# EAGLE design BLE_Board_WB55 (EAGLE 9.6.2)
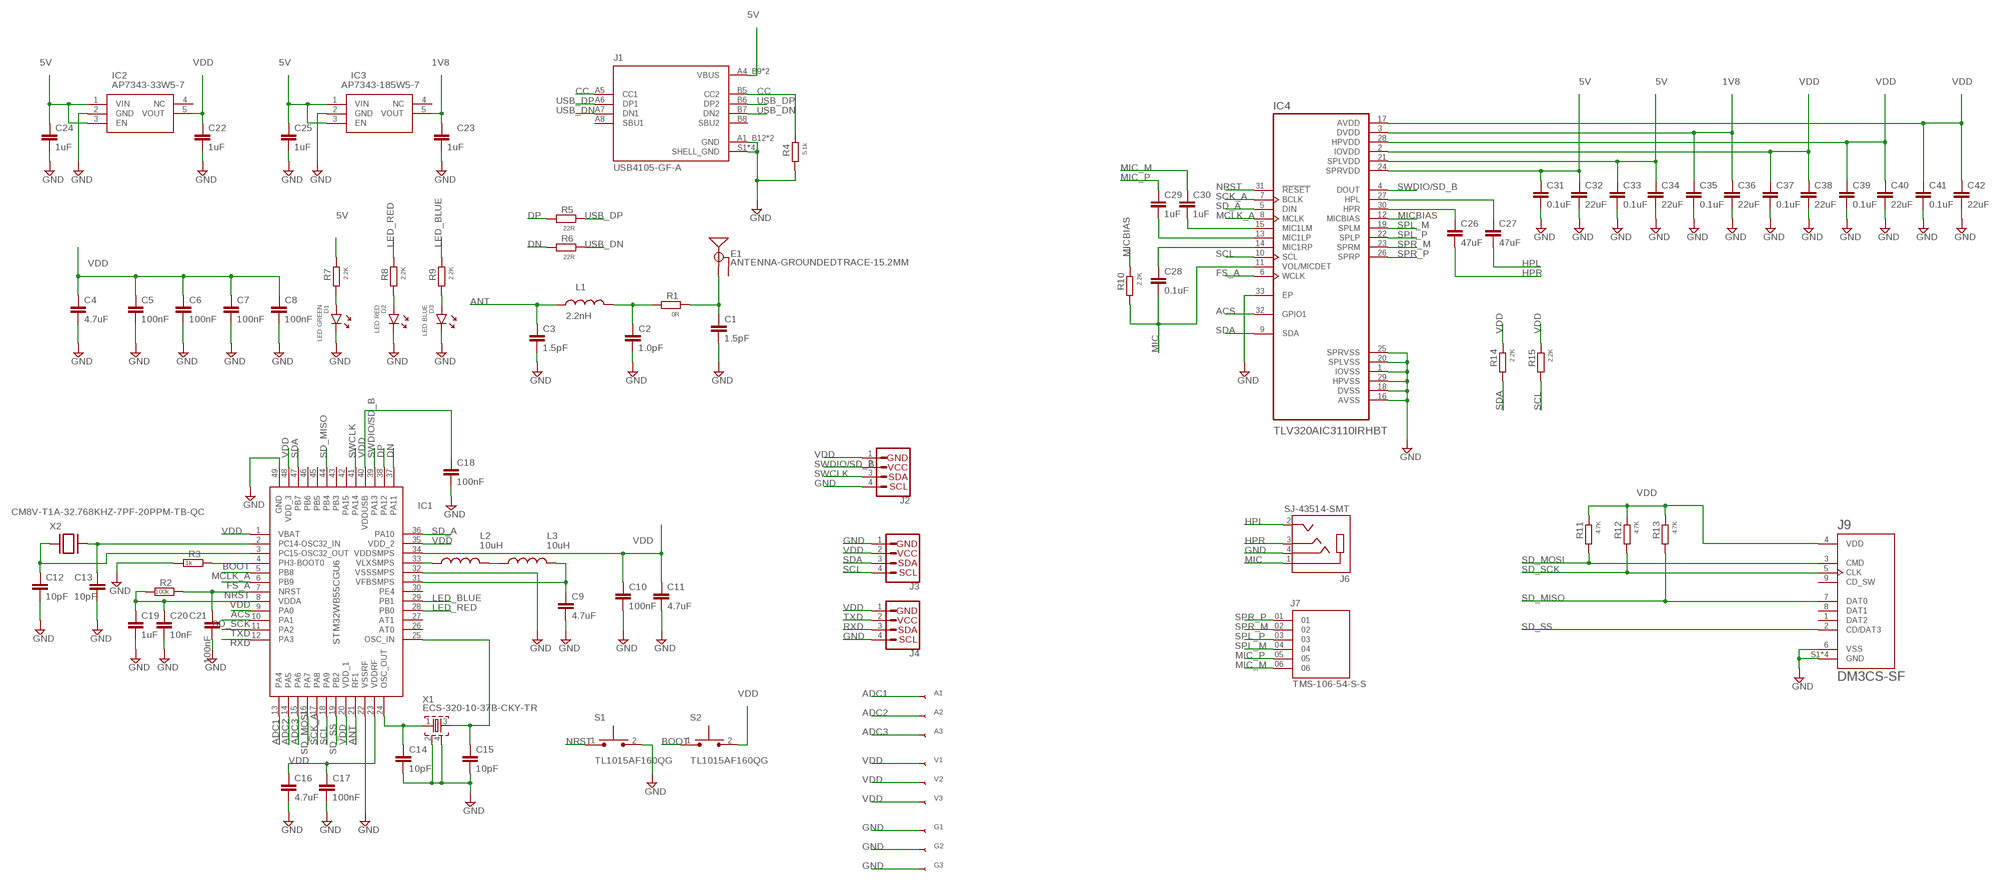
[diagram p0: schematic, sheet 1]

## Parts
A1  ATP-50  [ATP-50]
A2  ATP-50  [ATP-50]
A3  ATP-50  [ATP-50]
C1  1.5pF  CAPACITOR_0402_N  [RESC0402_N]
C2  1.0pF  CAPACITOR_0402_N  [RESC0402_N]
C3  1.5pF  CAPACITOR_0402_N  [RESC0402_N]
C4  4.7uF  CAPACITOR_0603_N  [RESC0603_N]
C5  100nF  CAPACITOR_0603_N  [RESC0603_N]
C6  100nF  CAPACITOR_0603_N  [RESC0603_N]
C7  100nF  CAPACITOR_0603_N  [RESC0603_N]
C8  100nF  CAPACITOR_0603_N  [RESC0603_N]
C9  4.7uF  CAPACITOR_0603_N  [RESC0603_N]
C10  100nF  CAPACITOR_0603_N  [RESC0603_N]
C11  4.7uF  CAPACITOR_0603_N  [RESC0603_N]
C12  10pF  CAPACITOR_0402_N  [RESC0402_N]
C13  10pF  CAPACITOR_0402_N  [RESC0402_N]
C14  10pF  CAPACITOR_0402_N  [RESC0402_N]
C15  10pF  CAPACITOR_0402_N  [RESC0402_N]
C16  4.7uF  CAPACITOR_0603_N  [RESC0603_N]
C17  100nF  CAPACITOR_0603_N  [RESC0603_N]
C18  100nF  CAPACITOR_0603_N  [RESC0603_N]
C19  1uF  CAPACITOR_0603_N  [RESC0603_N]
C20  10nF  CAPACITOR_0603_N  [RESC0603_N]
C21  100nF  CAPACITOR_0603_N  [RESC0603_N]
C22  1uF  CAPACITOR_0603_N  [RESC0603_N]
C23  1uF  CAPACITOR_0603_N  [RESC0603_N]
C24  1uF  CAPACITOR_0603_N  [RESC0603_N]
C25  1uF  CAPACITOR_0603_N  [RESC0603_N]
C26  47uF  CAPACITOR_0603_N  [RESC0603_N]
C27  47uF  CAPACITOR_0603_N  [RESC0603_N]
C28  0.1uF  CAPACITOR_0603_N  [RESC0603_N]
C29  1uF  CAPACITOR_0603_N  [RESC0603_N]
C30  1uF  CAPACITOR_0603_N  [RESC0603_N]
C31  0.1uF  CAPACITOR_0603_N  [RESC0603_N]
C32  22uF  CAPACITOR_0603_N  [RESC0603_N]
C33  0.1uF  CAPACITOR_0603_N  [RESC0603_N]
C34  22uF  CAPACITOR_0603_N  [RESC0603_N]
C35  0.1uF  CAPACITOR_0603_N  [RESC0603_N]
C36  22uF  CAPACITOR_0603_N  [RESC0603_N]
C37  0.1uF  CAPACITOR_0603_N  [RESC0603_N]
C38  22uF  CAPACITOR_0603_N  [RESC0603_N]
C39  0.1uF  CAPACITOR_0603_N  [RESC0603_N]
C40  22uF  CAPACITOR_0603_N  [RESC0603_N]
C41  0.1uF  CAPACITOR_0603_N  [RESC0603_N]
C42  22uF  CAPACITOR_0603_N  [RESC0603_N]
D1  LED GREEN  LED  [DIOC0603_N]
D2  LED RED  LED  [DIOC0603_N]
D3  LED BLUE  LED  [DIOC0603_N]
E1  ANTENNA-GROUNDEDTRACE-15.2MM  [TRACE_ANTENNA_2.4GHZ_15.2MM]
G1  ATP-50  [ATP-50]
G2  ATP-50  [ATP-50]
G3  ATP-50  [ATP-50]
IC1  STM32WB55CGU6  [QFN50P700X700X60-49N]
IC2  AP7343-33W5-7  [SOT95P285X140-5N]
IC3  AP7343-185W5-7  [SOT95P285X140-5N]
IC4  TLV320AIC3110IRHBT  [IC_ADS125H01IRHBT]
J1  USB4105-GF-A  [GCT_USB4105-GF-A]
J2  QWIIC_CONNECTORJS-1MM  [1X04_1MM_RA]
J3  QWIIC_CONNECTORJS-1MM  [1X04_1MM_RA]
J4  QWIIC_CONNECTORJS-1MM  [1X04_1MM_RA]
J6  SJ-43514-SMT  [CUI_SJ-43514-SMT]
J7  TMS-106-54-S-S  [SAMTEC_TMS-106-54-S-S]
J9  DM3CS-SF  [HRS_DM3CS-SF]
L1  2.2nH  INDUCTOR_0402_N  [RESC0402_N]
L2  10uH  INDUCTOR_0603_N  [RESC0603_N]
L3  10uH  INDUCTOR_0603_N  [RESC0603_N]
R1  0R  RESISTOR_0402_N  [RESC0402_N]
R2  100k  RESISTOR_0603_N  [RESC0603_N]
R3  1k  RESISTOR_0603_N  [RESC0603_N]
R4  5.1k  RESISTOR_0603_N  [RESC0603_N]
R5  22R  RESISTOR_0603_N  [RESC0603_N]
R6  22R  RESISTOR_0603_N  [RESC0603_N]
R7  2.2K  RESISTOR_0603_N  [RESC0603_N]
R8  2.2K  RESISTOR_0603_N  [RESC0603_N]
R9  2.2K  RESISTOR_0603_N  [RESC0603_N]
R10  2.2K  RESISTOR_0603_N  [RESC0603_N]
R11  4.7K  RESISTOR_0603_N  [RESC0603_N]
R12  4.7K  RESISTOR_0603_N  [RESC0603_N]
R13  4.7K  RESISTOR_0603_N  [RESC0603_N]
R14  2.2K  RESISTOR_0603_N  [RESC0603_N]
R15  2.2K  RESISTOR_0603_N  [RESC0603_N]
S1  TL1015AF160QG  [SW_TL1015AF160QG]
S2  TL1015AF160QG  [SW_TL1015AF160QG]
V1  ATP-50  [ATP-50]
V2  ATP-50  [ATP-50]
V3  ATP-50  [ATP-50]
X1  ECS-320-10-37B-CKY-TR  XTAL_32MHZ  [BT-XTAL_2016_N]
X2  CM8V-T1A-32.768KHZ-7PF-20PPM-TB-QC  [XTAL_CM8V-T1A-32.768KHZ-7PF-20PPM-TB-QC]

## Nets
1V8 [power]: C23.1 C35.1 C36.1 IC3.5(VOUT) IC4.3(DVDD)
5V [power]: C24.1 C25.1 C31.1 C32.1 C33.1 C34.1 IC2.1(VIN) IC2.3(EN) IC3.1(VIN) IC3.3(EN) IC4.21(SPLVDD) IC4.24(SPRVDD) J1.A4_B9(VBUS) J1.B4_A9(VBUS) R7.1
ACS: IC1.9(PA0) IC4.32(GPIO1)
ADC1: A1.P(TP) IC1.13(PA4)
ADC2: A2.P(TP) IC1.14(PA5)
ADC3: A3.P(TP) IC1.15(PA6)
ANT: C3.1 IC1.21(RF1) L1.1
BOOT: IC1.4(PH3-BOOT0) R3.1 S2.1
CC: J1.A5(CC1) J1.B5(CC2) R4.1
DN: IC1.37(PA11) R6.2
DP: IC1.38(PA12) R5.2
FS_A: IC1.6(PB9) IC4.6(WCLK)
GND [power]: C1.2 C2.2 C3.2 C4.2 C5.2 C6.2 C7.2 C8.2 C9.2 C10.2 C11.2 C12.2 C13.2 C14.2 C15.2 C16.2 C17.2 C18.2 C19.2 C20.2 C21.2 C22.2 C23.2 C24.2 C25.2 C31.2 C32.2 C33.2 C34.2 C35.2 C36.2 C37.2 C38.2 C39.2 C40.2 C41.2 C42.2 D1.1(C) D2.1(C) D3.1(C) G1.P(TP) G2.P(TP) G3.P(TP) IC1.22(VSSRF) IC1.32(VSSSMPS) IC1.49(GND) IC2.2(GND) IC3.2(GND) IC4.1(IOVSS) IC4.16(AVSS) IC4.18(DVSS) IC4.20(SPLVSS) IC4.25(SPRVSS) IC4.29(HPVSS) IC4.33(EP) J1.A1_B12(GND) J1.B1_A12(GND) J1.S1(SHELL_GND) J1.S2(SHELL_GND) J1.S3(SHELL_GND) J1.S4(SHELL_GND) J2.4 J3.1 J4.4 J6.4(RING2) J9.6(VSS) J9.S1(GND) J9.S2(GND) J9.S3(GND) J9.S5(GND) R3.2 R4.2 S1.2 X1.2 X1.4
HPL: C27.2 J6.2(TIP)
HPR: C26.2 J6.3(RING1)
LED_BLUE: IC1.29(PB1) R9.1
LED_RED: IC1.28(PB0) R8.1
MCLK_A: IC1.5(PB8) IC4.8(MCLK)
MIC: C28.2 IC4.11(VOL/MICDET) J6.1(SLEEVE) R10.2
MIC_M: C30.1 J7.06
MIC_P: C29.1 J7.05
MICBIAS: IC4.12(MICBIAS) R10.1
N$1: C1.1 E1.ANT(SIGNAL) R1.2
N$2: C2.1 L1.2 R1.1
N$3: IC1.33(VLXSMPS) L2.1
N$4: L2.2 L3.1
N$5: C9.1 IC1.31(VFBSMPS) L3.2
N$6: C13.1 IC1.2(PC14-OSC32_IN) X2.2
N$7: C12.1 IC1.3(PC15-OSC32_OUT) X2.1
N$8: C14.1 IC1.24(OSC_OUT) X1.1
N$9: C15.1 IC1.25(OSC_IN) X1.3
N$10: D1.2(A) R7.2
N$14: C26.1 IC4.30(HPR)
N$16: C28.1 IC4.14(MIC1RP)
N$17: D3.2(A) R9.2
N$18: D2.2(A) R8.2
N$19: C27.1 IC4.27(HPL)
N$20: C30.2 IC4.15(MIC1LM)
N$21: C29.2 IC4.13(MIC1LP)
NRST: C21.1 IC1.7(NRST) IC4.31(!RESET) R2.1 S1.1
RXD: IC1.12(PA3) J4.3
SCK_A: IC1.17(PA8) IC4.7(BCLK)
SCL: IC1.18(PA9) IC4.10(SCL) J3.4 R15.2
SD_A: IC1.36(PA10) IC4.5(DIN)
SD_MISO: IC1.44(PB4) J9.7(DAT0) R13.2
SD_MOSI: IC1.16(PA7) J9.3(CMD) R11.2
SD_SCK: IC1.10(PA1) J9.5(CLK) R12.2
SD_SS: IC1.19(PB2) J9.2(CD/DAT3)
SDA: IC1.47(PB7) IC4.9(SDA) J3.3 R14.2
SPL_M: IC4.19(SPLM) J7.04
SPL_P: IC4.22(SPLP) J7.03
SPR_M: IC4.23(SPRM) J7.02
SPR_P: IC4.26(SPRP) J7.01
SWCLK: IC1.41(PA14) J2.3
SWDIO/SD_B: IC1.39(PA13) IC4.4(DOUT) J2.2
TXD: IC1.11(PA2) J4.2
USB_DN: J1.A7(DN1) J1.B7(DN2) R6.1
USB_DP: J1.A6(DP1) J1.B6(DP2) R5.1
VDD [power]: C4.1 C5.1 C6.1 C7.1 C8.1 C10.1 C11.1 C16.1 C17.1 C18.1 C19.1 C20.1 C22.1 C37.1 C38.1 C39.1 C40.1 C41.1 C42.1 IC1.1(VBAT) IC1.8(VDDA) IC1.20(VDD_1) IC1.23(VDDRF) IC1.34(VDDSMPS) IC1.35(VDD_2) IC1.40(VDDUSB) IC1.48(VDD_3) IC2.5(VOUT) IC4.2(IOVDD) IC4.17(AVDD) IC4.28(HPVDD) J2.1 J3.2 J4.1 J9.4(VDD) R2.2 R11.1 R12.1 R13.1 R14.1 R15.1 S2.2 V1.P(TP) V2.P(TP) V3.P(TP)
Unconnected: E1.GND IC1.26(AT0) IC1.27(AT1) IC1.30(PE4) IC1.42(PA15) IC1.43(PB3) IC1.45(PB5) IC1.46(PB6) IC2.4(NC) IC3.4(NC) J1.A8(SBU1) J1.B8(SBU2) J9.1(DAT2) J9.8(DAT1) J9.9(CD_SW)

## Library data of the parts
A1-A3 G1-G3 V1-V3 = testpoint:ATP: AUTOMATED TEST POINT for automated bed of nails machinery; BOM: EXCLUDE; POGOPIN: T
C1-C42 = Nordic_misc:CAPACITOR: Generic chip capacitor
D1-D3 = Nordic_misc:LED
E1 = SparkFun-RF:ANTENNA-GROUNDED: Antenna w/ Ground Connection 2.4GHz antennae with signal and ground terminals. TRACE_ANTENNA_2.4GHZ_15.2MM - Meander Trace antenna 15.2 x 5.7mm footprint Based on layout from TI app note AN043. TRACE_ANTENNA_2.4GHZ_25.7MM - Inverted F trace antenna 25.7 x 7.5 mm footprint. Based on layout from TI design note DN0007.
IC1 = STM32WB55CGU6:STM32WB55CGU6: ARM Microcontrollers - MCU Ultra-low-power dual core Arm Cortex-M4 MCU 64 MHz, Cortex-M0 32MHz with 1 Mbyte Flash, BLE, 802.15.4, USB, LCD, AES-256 Source: Datasheet; ARROW_PART_NUMBER: STM32WB55CGU6; ARROW_PRICE-STOCK: https://www.arrow.com/en/products/stm32wb55cgu6/stmicroelectronics?region=nac; DESCRIPTION: ARM Microcontrollers - MCU Ultra-low-power dual core Arm Cortex-M4 MCU 64 MHz, Cortex-M0 32MHz with 1 Mbyte Flash, BLE, 802.15.4, USB, LCD, AES-256; HEIGHT: 0.6mm; MANUFACTURER_NAME: STMicroelectronics; MANUFACTURER_PART_NUMBER: STM32WB55CGU6; MOUSER_PART_NUMBER: 511-STM32WB55CGU6; MOUSER_PRICE-STOCK: https://www.mouser.co.uk/ProductDetail/STMicroelectronics/STM32WB55CGU6?qs=lYGu3FyN48eI3bRY%252B36gew%3D%3D
IC2 = AP7343-33W5-7:AP7343-33W5-7: 300mA HIGH PSRR LOW NOISE LDO WITH ENABLE SOT25 Source: Datasheet; ARROW_PART_NUMBER: AP7343-33W5-7; ARROW_PRICE-STOCK: https://www.arrow.com/en/products/ap7343-33w5-7/diodes-incorporated?region=nac; DESCRIPTION: 300mA HIGH PSRR LOW NOISE LDO WITH ENABLE SOT25; HEIGHT: 1.4mm; MANUFACTURER_NAME: Diodes Inc.; MANUFACTURER_PART_NUMBER: AP7343-33W5-7; MOUSER_PART_NUMBER: 621-AP7343-33W5-7; MOUSER_PRICE-STOCK: https://www.mouser.co.uk/ProductDetail/Diodes-Incorporated/AP7343-33W5-7?qs=EDJ299gKAZRup5M081DV0A%3D%3D
IC3 = AP7343-185W5-7:AP7343-185W5-7: DiodesZetex AP7343-185W5-7, LDO Regulator, 300mA, 1.85 V, +/-1%, 1.7 5.25 Vin, SOT-25 5-Pin Source: Datasheet; ARROW_PART_NUMBER: AP7343-185W5-7; ARROW_PRICE-STOCK: https://www.arrow.com/en/products/ap7343-185w5-7/diodes-incorporated; DESCRIPTION: DiodesZetex AP7343-185W5-7, LDO Regulator, 300mA, 1.85 V, +/-1%, 1.7 5.25 Vin, SOT-25 5-Pin; HEIGHT: 1.4mm; MANUFACTURER_NAME: Diodes Inc.; MANUFACTURER_PART_NUMBER: AP7343-185W5-7; MOUSER_PART_NUMBER: 621-AP7343-185W5-7; MOUSER_PRICE-STOCK: https://www.mouser.co.uk/ProductDetail/Diodes-Incorporated/AP7343-185W5-7?qs=EDJ299gKAZSDDLW23DUnJA%3D%3D
IC4 = TLV320AIC3110IRHBT:TLV320AIC3110IRHBT: Check availability; AVAILABILITY: In Stock; DESCRIPTION: Low-Power Audio Codec With 1.3W Stereo Class-D Speaker Amplifier; MF: Texas Instruments; MP: TLV320AIC3110IRHBT; PACKAGE: VQFN-32-32 Texas Instruments; PRICE: None; PURCHASE-URL: https://pricing.snapeda.com/search?q=TLV320AIC3110IRHBT&ref=eda
J1 = USB4105-GF-A:USB4105-GF-A: USB-C (USB TYPE-C) USB 2.0 Receptacle Connector 24 (16+8 Dummy) Position Surface Mount, Right Angle; Through Hole Check availability; AVAILABILITY: In Stock; DESCRIPTION: USB-C (USB TYPE-C) USB 2.0 Receptacle Connector 24 (16+8 Dummy) Position Surface Mount, Right Angle; Through Hole; MF: GCT; MP: USB4105-GF-A; PACKAGE: None; PRICE: None; PURCHASE-URL: https://pricing.snapeda.com/search?q=USB4105-GF-A&ref=eda
J2-J4 = SparkFun-Connectors:QWIIC_CONNECTOR: SparkFun I2C Standard Qwiic Connector An SMD 1mm pitch JST connector makes it easy and quick (get it? Qwiic?) to connect I2C devices to each other. The Qwiic system <http://www.sparkfun.com/qwiic> enables fast and solderless connection between popular platforms and various sensors and actuators. We carry 200mm <https://www.sparkfun.com/products/14204>, 100mm <https://www.sparkfun.com/products/14205>, 50mm <https://www.sparkfun.com/products/14206>, and breadboard friendly <https://www.sparkfun.com/products/14207> Qwiic cables. We also offer 10 pcs strips <https://www.sparkfun.com/products/14323> the SMD connectors.; PROD_ID: CONN-13694
J6 = SJ-43514-SMT:SJ-43514-SMT: 4 conductor 3.5 mm Surface Mount Audio Jack Check availability; AVAILABILITY: In Stock; CUI_PURCHASE_URL: https://www.cuidevices.com/product/interconnect/connectors/audio-connectors/jacks/sj-43514-smt-tr?utm_source=snapeda.com&utm_medium=referral&utm_campaign=snapedaBOM; DESCRIPTION: 4 conductor 3.5 mm Surface Mount Audio Jack; MF: CUI Devices; MP: SJ-43514-SMT-TR; PACKAGE: None; PRICE: None; PURCHASE-URL: https://pricing.snapeda.com/search?q=SJ-43514-SMT-TR&ref=eda
J7 = TMS-106-54-S-S:TMS-106-54-S-S: Check availability; AVAILABILITY: In Stock; DESCRIPTION: Connector Header Through Hole 6 position 0.050 (1.27mm); MF: Samtec; MP: TMS-106-54-S-S; PACKAGE: None; PRICE: None; PURCHASE-URL: https://pricing.snapeda.com/search?q=TMS-106-54-S-S&ref=eda
J9 = DM3CS-SF:DM3CS-SF: CONN MICRO SD CARD HINGED TYPE Check availability; AVAILABILITY: In Stock; DESCRIPTION: 10 (8 + 2) Position Card Connector Secure Digital - microSD™ Surface Mount, Right Angle Gold; MF: Hirose; MP: DM3CS-SF; PACKAGE: None; PRICE: None; PURCHASE-URL: https://pricing.snapeda.com/search?q=DM3CS-SF&ref=eda
L1-L3 = Nordic_misc:INDUCTOR: Generic chip inductor
R1-R15 = Nordic_misc:RESISTOR: Generic chip resistor
S1 S2 = TL1015AF160QG:TL1015AF160QG: Tactile Switch SPST-NO Top Actuated Surface Mount Check availability; AVAILABILITY: In Stock; DESCRIPTION: Tactile Switch SPST-NO Top Actuated Surface Mount; MF: E-Switch; MP: TL1015AF160QG; PACKAGE: None; PRICE: None; PURCHASE-URL: https://pricing.snapeda.com/search?q=TL1015AF160QG&ref=eda
X1 = Nordic_nRF:XTAL_32MHZ
X2 = CM8V-T1A-32.768KHZ-7PF-20PPM-TB-QC:CM8V-T1A-32.768KHZ-7PF-20PPM-TB-QC: Check availability; AVAILABILITY: In Stock; DESCRIPTION: LOW FREQUENCY CRYSTAL; MF: Micro Crystal AG; MP: CM8V-T1A-32.768KHZ-7PF-20PPM-TB-QC; PACKAGE: SMD-2 Micro Crystal; PRICE: None; PURCHASE-URL: https://pricing.snapeda.com/search?q=CM8V-T1A-32.768KHZ-7PF-20PPM-TB-QC&ref=eda

## Net classes
0 default: width 0.178 mm
3 power: width 0.254 mm

## Board
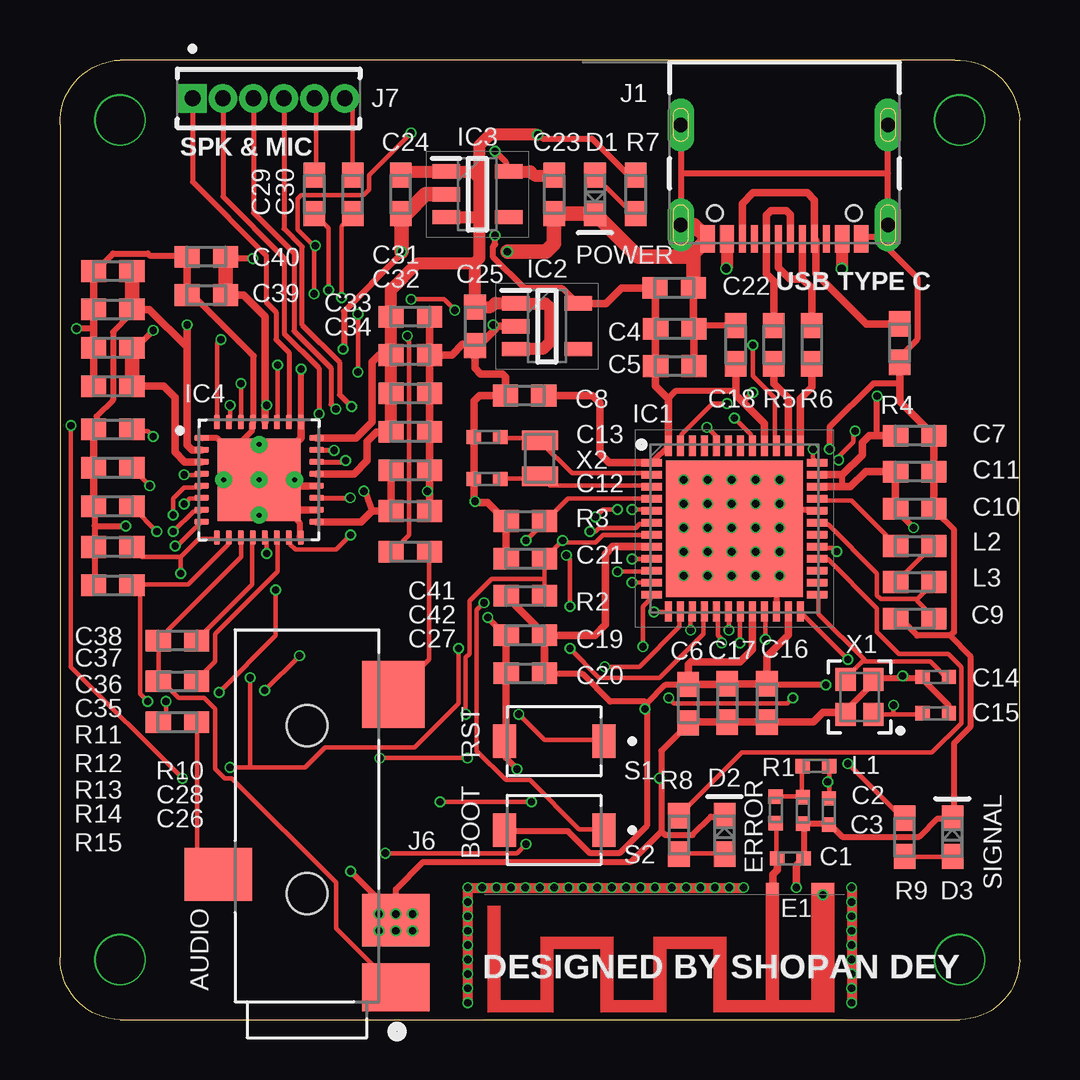
[diagram p1: board, top side]
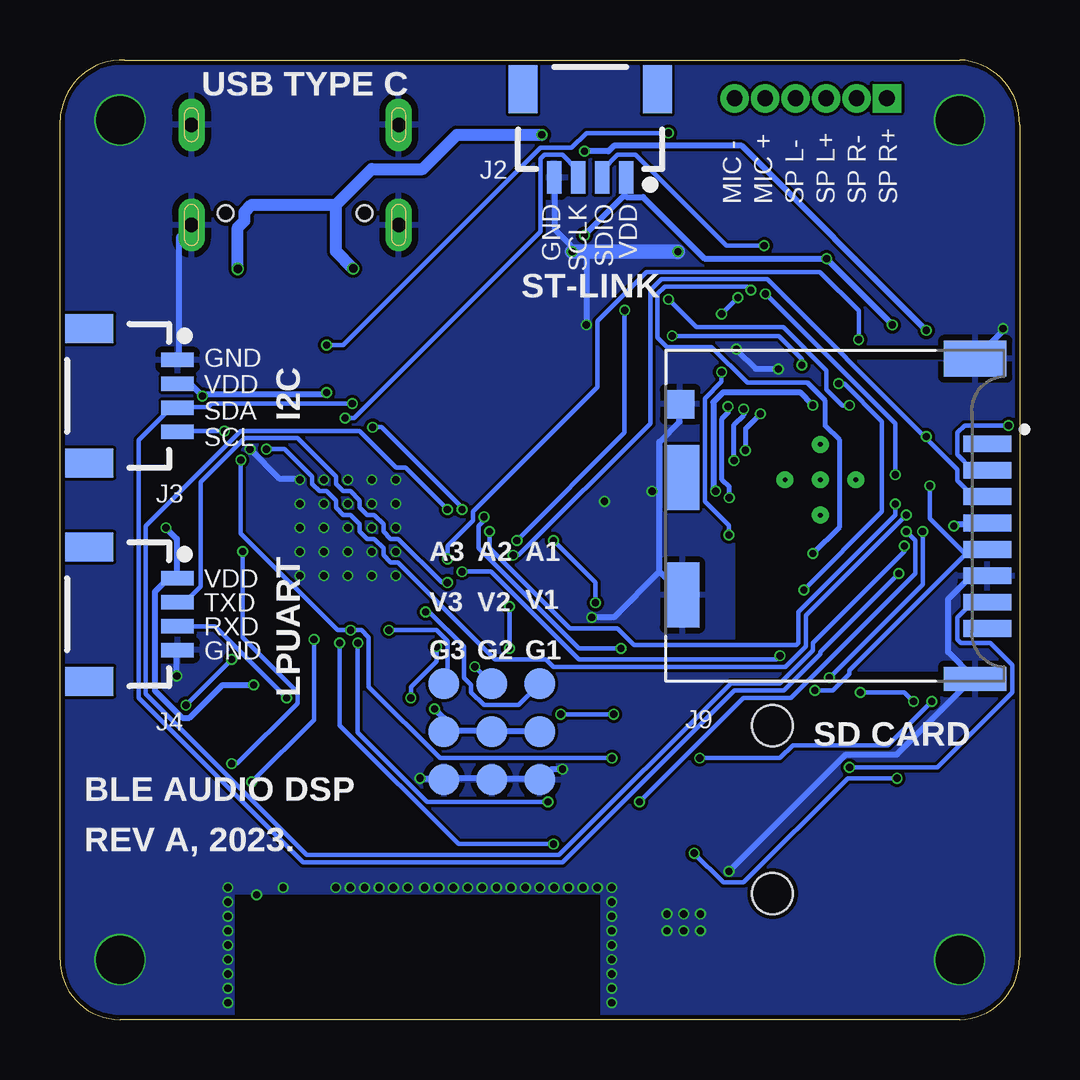
[diagram p2: board, bottom side, seen from below]

Size 40 x 40 mm. Coordinates in mm from the lower left corner, seen from the top.
Outline: 2.5,0 37.5,0 arc90 40,2.5 40,37.5 arc90 37.3,40 2.5,40 arc90 0,37.3 0,2.6 arc90 2.5,0
Copper layers (1*16): Top 0.035mm / dielectric 1.6mm / Bottom 0.035mm
Design rules "jlcpcb-2layers *": minimum track width 5mil, minimum drill 0.3mm, track to track 5mil, track to pad 5mil, pad to pad 5mil, via to via 5mil, smd to smd 5mil, copper to edge 0.2mm, drill to drill 6mil, minimum pad ring 10mil, minimum via ring 3mil, stop-mask expansion 4mil, vias tented up to drill 40mil, thermal gap 10mil
tRestrict: area 17.5,0.1 to 32.7,5.2
bRestrict: area 17.5,0.1 to 32.7,5.2
vRestrict: area 17.2,-0.6 to 32.9,5.2

### Footprints (pad centres in the part's own frame; a part is rotated, then mirrored left to right if it is on the bottom)
ATP-50 = smd 1.27 x 1.27: P 0,0
RESC0402_N = smd 0.6 x 0.6: 1 -0.55,0; 2 0.55,0
RESC0603_N = smd 1.05 x 0.9: 1 -0.8,0; 2 0.8,0
DIOC0603_N = smd 1.05 x 0.9: 1 -0.8,0; 2 0.8,0
TRACE_ANTENNA_2.4GHZ_15.2MM = smd 0.5 x 0.5: ANT 0,-0.25 | smd 0.9 x 0.5: GND -2.1,-0.25
QFN50P700X700X60-49N = smd 0.85 x 0.3: 1 -3.45,2.75; 2 -3.45,2.25; 3 -3.45,1.75; 4 -3.45,1.25; 5 -3.45,0.75; 6 -3.45,0.25; 7 -3.45,-0.25; 8 -3.45,-0.75; 9 -3.45,-1.25; 10 -3.45,-1.75; 11 -3.45,-2.25; 12 -3.45,-2.75; 25 3.45,-2.75; 26 3.45,-2.25; 27 3.45,-1.75; 28 3.45,-1.25; 29 3.45,-0.75; 30 3.45,-0.25; 31 3.45,0.25; 32 3.45,0.75; 33 3.45,1.25; 34 3.45,1.75; 35 3.45,2.25; 36 3.45,2.75 | smd 0.3 x 0.85: 13 -2.75,-3.45; 14 -2.25,-3.45; 15 -1.75,-3.45; 16 -1.25,-3.45; 17 -0.75,-3.45; 18 -0.25,-3.45; 19 0.25,-3.45; 20 0.75,-3.45; 21 1.25,-3.45; 22 1.75,-3.45; 23 2.25,-3.45; 24 2.75,-3.45; 37 2.75,3.45; 38 2.25,3.45; 39 1.75,3.45; 40 1.25,3.45; 41 0.75,3.45; 42 0.25,3.45; 43 -0.25,3.45; 44 -0.75,3.45; 45 -1.25,3.45; 46 -1.75,3.45; 47 -2.25,3.45; 48 -2.75,3.45 | smd 5.7 x 5.7: 49 0,0
SOT95P285X140-5N = smd 1.15 x 0.6: 1 -1.3,0.95; 2 -1.3,0; 3 -1.3,-0.95; 4 1.3,-0.95; 5 1.3,0.95
IC_ADS125H01IRHBT = smd 0.6 x 0.25: 1 -2.4,1.75; 2 -2.4,1.25; 3 -2.4,0.75; 4 -2.4,0.25; 5 -2.4,-0.25; 6 -2.4,-0.75; 7 -2.4,-1.25; 8 -2.4,-1.75; 17 2.4,-1.75; 18 2.4,-1.25; 19 2.4,-0.75; 20 2.4,-0.25; 21 2.4,0.25; 22 2.4,0.75; 23 2.4,1.25; 24 2.4,1.75 | smd 0.25 x 0.6: 9 -1.75,-2.4; 10 -1.25,-2.4; 11 -0.75,-2.4; 12 -0.25,-2.4; 13 0.25,-2.4; 14 0.75,-2.4; 15 1.25,-2.4; 16 1.75,-2.4; 25 1.75,2.4; 26 1.25,2.4; 27 0.75,2.4; 28 0.25,2.4; 29 -0.25,2.4; 30 -0.75,2.4; 31 -1.25,2.4; 32 -1.75,2.4 | smd 3.45 x 3.45: 33 0,0 | drill 0.2 pad 0.4: 34 0,0; 35 0,1.475; 36 -1.475,0; 37 0,-1.475; 38 1.475,0
GCT_USB4105-GF-A = smd 0.6 x 1.15: A1_B12 -3.2,4.755; A4_B9 -2.4,4.755; B1_A12 3.2,4.755; B4_A9 2.4,4.755 | smd 0.3 x 1.15: A5 -1.25,4.755; A6 -0.25,4.755; A7 0.25,4.755; A8 1.25,4.755; B5 1.75,4.755; B6 0.75,4.755; B7 -0.75,4.755; B8 -1.75,4.755 | drill 0.6 pad 1.05 long: S1 -4.32,4.18; S4 4.32,4.18 | drill 0.6 pad 1 long: S2 -4.32,0; S3 4.32,0 | hole 0.65: 2.89,3.68; -2.89,3.68
1X04_1MM_RA = smd 0.6 x 1.35: 1 -1.5,0; 2 -0.5,0; 3 0.5,0; 4 1.5,0 | smd 1.2 x 2: NC1 2.8,-3.675; NC2 -2.8,-3.675
CUI_SJ-43514-SMT = smd 2 x 2.8: 1 -7.15,-3.7 | smd 2.8 x 2.6: 2 5.05,-3.6 | smd 2.2 x 2.8: 3 -2.45,3.7; 4 -4.35,-3.7 | hole 1.7: -3.25,0; 3.75,0
SAMTEC_TMS-106-54-S-S = drill 0.66 pad 1.01 square: 01 -3.175,0 | drill 0.66 pad 1.01: 02 -1.905,0; 03 -0.635,0; 04 0.635,0; 05 1.905,0; 06 3.175,0
HRS_DM3CS-SF = smd 0.7 x 2: 1 3.2,-6.35; 2 2.1,-6.35; 3 1,-6.35; 4 -0.1,-6.35; 5 -1.2,-6.35; 6 -2.3,-6.35; 7 -3.4,-6.35; 8 -4.5,-6.35 | smd 2.7 x 1.4: 9 1.8,6.35; S3 -3.1,6.35 | smd 1 x 2.6: S1 -6.6,-5.85 | smd 1.5 x 2.6: S2 6.75,-5.85 | smd 1.2 x 1.2: S5 4.85,6.45
SW_TL1015AF160QG = smd 0.95 x 1.4: 1 -2.075,0; 2 2.075,0
BT-XTAL_2016_N = smd 0.95 x 0.85: 1 -0.725,-0.575; 2 0.725,-0.575; 3 0.725,0.575; 4 -0.725,0.575
XTAL_CM8V-T1A-32.768KHZ-7PF-20PPM-TB-QC = smd 0.8 x 1.5: 1 -0.75,0; 2 0.75,0

### Placement (x,y rotation side)
A1  20,14 0 bottom
A2  22,14 0 bottom
A3  24,14 0 bottom
C1  30.45,6.72 0 top
C2  30.97,8.72 270 top
C3  32.05,8.67 270 top
C4  25.63,28.79 0 top
C5  25.63,27.24 0 top
C6  26.19,13.17 270 top
C7  35.63,24.34 0 top
C8  19.37,26.01 180 top
C9  35.63,16.71 180 top
C10  35.63,21.29 0 top
C11  35.63,22.84 0 top
C12  17.8,22.53 180 top
C13  17.8,24.28 180 top
C14  36.5,12.77 0 top
C15  36.5,14.28 180 top
C16  29.47,13.2 270 top
C17  27.82,13.2 270 top
C18  28.17,28.13 90 top
C19  19.4,16.02 180 top
C20  19.4,14.43 180 top
C21  19.4,19.21 180 top
C22  25.6,30.5 0 top
C23  20.6,34.4 270 top
C24  14.2,34.4 270 top
C25  17.3,28.9 270 top
C26  4.9,12.4 0 top
C27  14.6,19.5 0 top
C28  4.9,14.1 180 top
C29  10.6,34.4 270 top
C30  12.2,34.4 270 top
C31  14.6,29.3 0 top
C32  14.6,27.7 0 top
C33  14.6,26.1 0 top
C34  14.6,24.5 0 top
C35  2.2,26.4 180 top
C36  2.2,28 180 top
C37  2.2,29.6 180 top
C38  2.2,31.2 180 top
C39  6.1,30.2 180 top
C40  6.1,31.8 180 top
C41  14.6,22.9 0 top
C42  14.6,21.2 0 top
D1  22.3,34.4 90 top
D2  27.7,7.7 270 top
D3  37.2,7.6 270 top
E1  29.7,5.2 180 top
G1  20,10 0 bottom
G2  22,10 0 bottom
G3  24,10 0 bottom
IC1  28.11,20.46 0 top
IC2  20.3,28.9 0 top
IC3  17.4,34.4 0 top
IC4  8.3,22.5 0 top
J1  30.2,37.3 180 top
J2  17.9,35.1 180 bottom
J3  35.1,26 270 bottom
J4  35.1,16.9 270 bottom
J6  10.3,8.5 90 top
J7  8.7,38.4 0 top
J9  7.7,20.8 90 bottom
L1  31.51,10.57 180 top
L2  35.63,19.74 0 top
L3  35.63,18.24 0 top
R1  29.84,8.74 270 top
R2  19.4,17.66 180 top
R3  19.4,20.78 180 top
R4  35,28.2 270 top
R5  29.75,28.13 270 top
R6  31.34,28.13 270 top
R7  24,34.4 270 top
R8  25.8,7.7 270 top
R9  35.2,7.6 270 top
R10  4.9,15.8 180 top
R11  2.2,24.6 0 top
R12  2.2,23 0 top
R13  2.2,21.4 0 top
R14  2.2,19.7 0 top
R15  2.2,18.1 0 top
S1  20.6,11.6 180 top
S2  20.6,7.9 180 top
V1  20,12 0 bottom
V2  22,12 0 bottom
V3  24,12 0 bottom
X1  33.33,13.45 90 top
X2  20,23.4 90 top

### Tracks (layer width: path | path; a pad name or v marks a point on that pad's centre or on a via)
1V8  (via drill 0.3)
  Top 0.254: v18.14,36.2 18.59,35.74 18.59,35.59 IC3.5 | v3.89,28.73 3.28,28.12 C36.1
  Top 0.305: C35.1 4.33,26.4 4.8,25.93 4.8,23.65 5.2,23.25 IC4.3
  Top 0.508: IC3.5 19.62,35.35 19.79,35.18 20.58,35.18 C23.1
  Top 0.61: C36.1 C35.1
  Bottom 0.254: v18.14,36.2 17.14,36.2 16.92,36.42 11.58,36.42 v3.89,28.73
5V  (via drill 0.3, 0.35)
  Top 0.254: R7.1 23.93,35.2 23.7,35.2 22.17,36.73 20.12,36.73 v19.91,36.88
  Top 0.305: IC4.24 12.35,24.25 13,24.9 13,27.4 13.3,27.7 C32.1 | IC4.21 12.25,22.75 12.8,23.3 12.8,24.1 13.2,24.5 C34.1
  Top 0.508: C24.1 14.35,35.35 IC3.1 17.2,35.35 17.48,35.08 | 17.48,35.08 17.48,33.43 | 17.48,33.43 17.48,31.73 17.27,31.52 | 17.27,31.52 17.27,29.73 C25.1 17.96,29.7 18.14,29.87 18.98,29.87 IC2.1 20.24,29.85 20.42,29.67 20.42,28.25 20.13,27.95 IC2.3 | IC3.3 17.45,33.45 17.48,33.43 | 17.27,31.52 14.91,31.52 13.8,30.41 C31.1 C32.1 C33.1 C34.1 | J1.B4_A9 27.8,31.33 v27.77,31.3 | v19.91,36.88 17.93,36.88 17.48,36.42 17.48,35.08 | J1.A4_B9 32.6,31.3 v32.59,31.29
  Bottom 0.508: v27.77,31.3 28.5,32.03 28.5,33.96 | 28.5,33.96 27,35.45 24.88,35.45 23.46,36.88 v19.91,36.88 | v32.59,31.29 32.59,33.02 32.31,33.3 32.31,33.65 32,33.96 28.5,33.96
ACS  (via drill 0.3)
  Top 0.178: v6.71,28.35 6.55,28.19 6.55,24.92 IC4.32 | v23.85,19.2 24.61,19.2 IC1.9
  Bottom 0.178: v6.71,28.35 6.71,29.56 8.31,31.17 15.54,31.17 17.6,29.11 17.6,26.36 22.78,21.18 22.78,20.8 23.85,19.74 v23.85,19.2
ADC1  (via drill 0.3)
  Top 0.178: v24.77,16.99 25.3,16.99 IC1.13
  Bottom 0.178: v24.77,16.99 24.61,16.99 23.16,15.54 23.16,14.25 22.86,13.95 22.86,13.64 22.33,13.11 20.88,13.11 20.04,13.95 A1.P
ADC2  (via drill 0.3)
  Top 0.178: v22.71,14.71 24.16,14.71 25.83,16.38 25.83,16.99 IC1.14
  Bottom 0.178: v22.71,14.71 22.02,14.02 A2.P
ADC3  (via drill 0.3)
  Top 0.178: v26.29,16.23 26.29,16.99 IC1.15
  Bottom 0.178: v26.29,16.23 24.31,16.23 23.85,15.77 23.85,14.1 23.93,14.02 A3.P
ANT  (via drill 0.3)
  Top 0.178: 32.08,9.91 32.08,10.52 L1.1 | 32.08,9.91 32.08,9.22 C3.1 | v29.41,15.85 29.41,16.99 IC1.21 | v32,9.91 32.08,9.91
  Bottom 0.178: v29.41,15.85 29.41,12.5 v32,9.91
BOOT  (via drill 0.3)
  Top 0.178: IC1.4 24.61,21.72 21.18,21.72 20.27,20.8 R3.1 20.19,20.73 v19.43,19.96 | v17.68,17.37 17.37,17.07 17.37,11.2 18.59,9.98 19.58,9.98 21.64,7.92 22.63,7.92 S2.1
  Bottom 0.178: v17.68,17.37 17.68,18.21 v19.43,19.96
CC
  Top 0.305: J1.B5 28.45,34.02 28.89,34.46 31.15,34.46 31.45,34.16 J1.A5 31.52,32.47 31.52,31.09 33.61,29 R4.1
DN
  Top 0.305: 31.34,27.03 R6.2 31.34,26.37 30.86,25.89 IC1.37
DP
  Top 0.305: IC1.38 30.36,25.9 29.75,26.51 R5.2
FS_A  (via drill 0.3)
  Top 0.178: v5.18,21.49 5.41,21.72 5.87,21.72 IC4.6 | v22.1,20.34 22.33,20.34 22.48,20.5 24,20.5 24.16,20.65 24.61,20.65 IC1.6
  Bottom 0.178: v5.18,21.49 5.18,21.03 9.22,16.99 9.22,15.7 9.3,15.62 16.08,15.62 16.76,16.31 18.75,16.31 22.1,19.66 v22.1,20.34
GND  (via drill 0.3, 2)
  Top 0.254: 35.13,14.25 33.91,14.25 X1.2 33.83,14.1 33.83,13.95 32.77,12.88 X1.4 | 35.13,14.25 35.89,14.25 C15.2 35.97,14.17 37.03,13.11 37.03,12.8 C14.2 | v35.13,14.33 35.13,14.25 | 25.07,7.85 25.22,7.7 26.36,7.7 27.13,8.46 27.66,8.46 D2.1 | 25.07,10.06 25.07,11.2 26.14,12.27 C6.2 | 25.07,10.06 25.07,7.85 | v24.99,10.06 25.07,10.06 | v19.05,10.44 18.59,10.9 18.59,11.51 S1.2 | 25.07,7.85 23.77,6.55 15.12,6.55 14,5.43 v14,4.4 J6.4 13.87,4.42 v12.12,6.17 | IC1.49 26.06,19.43 26.06,18.52 v26,18.5 26.14,18.52 26.98,18.52 v27,18.5 | v26,19.5 26.06,19.51 IC1.49 | v26,20.5 26.06,20.5 26.67,19.89 IC1.49 | v26,21.5 26.06,21.49 26.98,21.49 IC1.49 | v26,22.5 26.06,22.48 26.98,22.48 IC1.49 | v27,19.5 27.05,19.51 27.05,19.81 IC1.49 | v27,20.5 27.05,20.5 27.05,20.12 IC1.49 | v27,21.5 27.05,21.49 IC1.49 | v27,22.5 27.05,22.48 IC1.49 | IC1.49 28.04,19.43 28.04,18.52 v28,18.5 28.12,18.52 28.96,18.52 v29,18.5 29.11,18.52 29.95,18.52 v30,18.5 29.87,18.44 29.87,17.07 IC1.22 | IC1.49 28.04,19.51 v28,19.5 28.12,19.51 28.96,19.51 v29,19.5 29.11,19.51 29.95,19.51 v30,19.5 | IC1.49 28.04,20.5 v28,20.5 28.19,20.5 28.96,20.5 v29,20.5 29.11,20.5 29.95,20.5 v30,20.5 | IC1.49 27.66,21.49 27.96,21.49 v28,21.5 28.12,21.49 28.96,21.49 v29,21.5 29.11,21.49 29.95,21.49 v30,21.5 30.1,21.49 30.33,21.26 31.55,21.26 IC1.32 | IC1.49 27.43,21.95 27.96,22.48 v28,22.5 28.12,22.48 28.96,22.48 v29,22.5 29.11,22.48 29.95,22.48 v30,22.5 | C1.2 31.01,6.78 31.01,8.08 C2.2 31.01,8.15 32,8.15 C3.2 32.16,8.08 32.61,7.62 35.81,7.62 36.58,8.38 37.19,8.38 D3.1 37.26,8.46 37.26,11.51 37.95,12.19 37.95,15.16 37.11,16
  Top 0.254: 37.11,16 35.74,16 35.05,16.69 34.9,16.69 C9.2 | 37.11,16 37.26,16.15 37.26,20.42 36.5,21.18 C10.2 | J1.A1_B12 33.45,32.61 34.06,32.61 34.52,33.07 J1.S1 | 34.52,35.28 34.52,33.22 J1.S1 | 34.52,35.28 34.52,37.26 J1.S2 | R4.2 35.05,27.51 35.05,27.66 35.74,28.35 35.74,30.94 34.14,32.54 J1.S1 | v32.08,23.77 32.08,24.69 33.91,26.52 35,26.52 | C40.2 5.17,31.85 3.73,31.85 3.66,31.93 2.21,31.93 1.52,31.24 C38.2 | IC4.16 9.98,20.12 9.98,20.73 9.6,21.11 IC4.33 | IC4.1 5.94,24.23 6.55,24.23 7.62,23.16 IC4.33 | 9.52,21.32 9.47,21.37 IC4.33 | 10.82,21.26 IC4.18 | IC4.33 7.16,23.7 8,24.54 8,24.84 IC4.29 8.08,24.99 8.08,27.66 5.54,30.2 C39.2 | 1.4,28.8 v0.69,28.8 | v15.32,22.02 15.4,22.02 | C18.2 28.12,28.96 26.52,28.96 C4.2 | 25.91,35.28 25.91,33.38 J1.S4 | 25.91,35.28 25.91,37.26 J1.S3 | v18.06,28.96 18.06,28.88 18.15,28.79 | IC4.25 v10.05,27.12 | v14.24,32.02 14.1,31.77 11.84,29.51 11.84,27.98 v11.8,27.95 | 25.91,35.28 34.52,35.28 | v17.83,16.76 18.52,16.08 C19.2
  Top 0.305: C35.2 C36.2 1.4,28.8 C37.2 C38.2 | C40.2 C39.2 | C10.2 C11.2 C7.2 35,25.77 35,26.52 R4.2 | C5.2 C4.2 26.4,28.82 C22.2 | C32.2 C33.2 C34.2 C41.2 15.4,22.02 C42.2 | C32.2 C31.2 | 17.25,28.15 16.79,28.15 16.34,27.7 C32.2 | 17.46,28.1 18.15,28.79 18.26,28.9 IC2.2 | C19.2 C20.2 18.6,11.68 S1.2 | C21.2 R3.2 17.83,21.55 17.34,21.55 17.25,21.64 C12.2 C13.2 17.25,25.78 17.48,26.01 C8.2 18.57,26.79 18.45,26.91 17.54,26.91 17.3,27.15 C25.2 | C6.2 26.22,12.4 C17.2 C16.2 31.4,12.4 31.8,12.8 32.68,12.8 X1.4 | 9.65,23.65 9.6,23.6 9.4,23.6 IC4.33 | IC4.33 8.3,22.6 7.75,23.15 | 9.55,21.25 IC4.33 | IC4.25 10.05,24.25 IC4.33 | IC4.20 9.75,22.25 9.7,22.3 9.47,22.07 9.47,21.37 | IC4.18 9.59,21.25 9.52,21.32 | v30.7,5.5 30.7,6.42 C1.2
  Top 0.406: v17,0.7 v17,5.5 v28.5,5.5 | v33,5.5 v33,0.7
  Top 0.61: IC3.2 15.24,34.4 14.44,33.6 C24.2 14.24,33.55 v14.24,32.02 | 26.4,31.95 26.27,31.81 24.09,31.81 D1.1 C23.2 20.6,32.35 20.26,32.01 v18.65,32.01 | 26.4,31.95 J1.B1_A12 26.43,33.12 J1.S4 | C22.2 26.4,31.95 | 17.25,28.15 C25.2 17.46,28.1 | 14.15,4 J6.4
  Bottom 0.254: J9.6 1.37,18.44 2.06,18.44 2.97,17.53 2.97,15.32 1.91,14.25 J9.S1 1.98,14.17 5.11,11.05 7.24,11.05 v12.12,6.17 | v35.13,14.33 35.13,15.39 J4.4 | v24.99,10.06 24.08,10.06 G3.P 23.93,10.06 22.1,10.06 G2.P 21.95,10.06 20.04,10.06 G1.P 19.89,10.06 19.51,10.44 v19.05,10.44 | J3.1 35.05,27.51 35.05,32.61 34.59,33.07 J1.S1 | v32.08,23.77 30.86,22.55 30.02,22.55 v30,22.5 | v0.69,28.8 0.69,28.73 1.83,27.58 J9.S2 | 15.01,18.67 15.01,22.02 | 15.01,22.02 15.01,24.08 14.17,24.92 14.17,25.6 J9.S5 | 15.01,18.67 14.1,17.75 J9.S3 | v15.32,22.02 15.01,22.02 | J2.4 19.36,35.05 19.36,32.92 18.75,32.31 v18.65,32.01 | 18.06,32.01 v18.06,28.96 | v17.83,16.76 16.92,16.76 15.01,18.67 | v11.8,27.95 11.8,27.92 11,27.12 v10.05,27.12
  Bottom 0.61: v18.65,32.01 18.06,32.01 14.27,32.01 14.26,32 v14.24,32.02
  other vias: 31.8,5.2 17,1.3 17,2.5 17,3.1 17,3.7 17,4.3 17,4.9 17,1.9 17.6,5.5 18.2,5.5 18.8,5.5 19.4,5.5 20,5.5 20.6,5.5 21.2,5.5 21.8,5.5 22.4,5.5 23,5.5 23.6,5.5 24.2,5.5 24.8,5.5 25.5,5.5 26.1,5.5 26.7,5.5 27.3,5.5 27.9,5.5 33,4.9 33,4.3 33,3.7 33,3.1 33,2.5 33,1.9 33,1.3 37.5,2.5 37.5,37.5 2.5,37.5 2.5,2.5 17.3,21.6 13.3,4.4 13.3,3.7 14,3.7 14.7,3.7 14.7,4.4
  pour Bottom: 0,0 0,40.1 40,40.1 40,0 0.1,0
HPL
  Top 0.178: C27.2 15.39,19.43 15.39,15.01 13.95,13.56 J6.2
HPR
  Top 0.178: C26.2 5.71,12.34 5.71,6.93 6.55,6.1 J6.3
LED_BLUE  (via drill 0.3)
  Top 0.178: v32.38,19.51 32.23,19.66 31.62,19.66 IC1.29 | v32.84,10.67 35.13,8.38 R9.1
  Bottom 0.178: v32.38,19.51 32.38,15.93 30.1,13.64 30.1,13.18 32.61,10.67 v32.84,10.67
LED_RED
  Top 0.178: IC1.28 31.62,19.2 32,19.2 34.06,17.14 34.06,16.15 34.98,15.24 37.03,15.24 37.57,14.71 37.57,12.34 36.35,11.12 28.42,11.12 25.83,8.53 R8.1
MCLK_A  (via drill 0.3)
  Top 0.178: v4.8,19.74 4.88,19.74 5.87,20.73 IC4.8 | v23.85,21.26 24.61,21.26 IC1.5
  Bottom 0.178: v4.8,19.74 4.8,19.51 8.61,15.7 8.61,15.39 9.98,14.02 12.04,14.02 19.2,6.86 29.72,6.86 36.42,13.56 36.42,20.57 32.46,24.54 27.51,24.54 25.98,23.01 25.6,23.01 v23.85,21.26
MIC
  Top 0.178: IC4.11 7.54,20.04 7.54,19.28 4.12,15.85 R10.2 4.12,15.77 4.12,14.17 C28.2 4.19,14.17 4.95,13.41 6.02,13.41 6.48,12.95 6.48,10.44 6.86,10.06 7.16,10.06 11.51,5.71 11.51,3.81 13.95,1.37 J6.1
MIC_M
  Top 0.178: C30.1 12.19,38.02 11.89,38.33 J7.06
MIC_P
  Top 0.178: C29.1 10.67,35.2 10.67,38.33 J7.05
MICBIAS
  Top 0.178: IC4.12 8,20.04 8,18.14 5.71,15.85 R10.1
N$1
  Top 0.178: R1.2 29.87,8.15 29.87,6.86 C1.1
  Top 0.305: C1.1 29.9,6.24 29.71,6.05 E1.ANT
N$2
  Top 0.178: R1.1 29.87,9.3 30.94,9.3 C2.1 30.94,9.37 30.94,10.52 L1.2
N$3
  Top 0.178: IC1.33 31.62,21.64 32.99,21.64 34.82,19.81 L2.1
N$4
  Top 0.178: L3.1 34.9,18.29 36.42,19.81 L2.2
N$5
  Top 0.178: 35.74,17.53 34.21,17.53 34.06,17.68 34.06,18.59 32,20.65 31.62,20.65 IC1.31 | 35.74,17.53 36.42,18.21 L3.2 | C9.1 36.42,16.76 35.74,17.45 35.74,17.53
N$6
  Top 0.178: C13.1 18.36,24.23 19.89,24.23 19.96,24.16 X2.2 20.04,24.08 21.34,22.78 24.61,22.78 IC1.2
N$7
  Top 0.178: C12.1 18.36,22.55 19.89,22.55 19.96,22.63 X2.1 20.04,22.63 20.42,22.25 24.61,22.25 IC1.3
N$8  (via drill 0.3)
  Top 0.178: 34.75,12.72 X1.1 | 34.75,12.72 35.89,12.72 C14.1 | v32.84,15.01 30.86,16.99 IC1.24 | 34.75,12.72 v34.75,13.11
  Bottom 0.178: v34.75,13.11 v32.84,15.01
N$9
  Top 0.178: 33.53,14.94 33.45,14.94 32.77,14.25 X1.3 | 33.53,14.94 36.27,14.94 36.88,14.33 37.03,14.33 C15.1 | IC1.25 31.62,17.68 31.62,16.92 33.53,15.01 33.53,14.94
N$10
  Top 0.178: D1.2 22.33,35.13 23.93,33.53 R7.2
N$14  (via drill 0.3)
  Top 0.178: v7.54,26.51 IC4.30 | v8.99,17.91 8.99,16 v6.63,13.64 | v4.42,13.26 4.42,12.72 4.12,12.42 C26.1
  Bottom 0.178: v7.54,26.51 7.31,26.51 5.73,24.93 5.73,21.17 v8.99,17.91 | v6.63,13.64 4.8,13.64 v4.42,13.26
N$16
  Top 0.178: IC4.14 9.07,20.04 9.07,18.67 6.48,16.08 6.48,14.94 5.71,14.17 C28.1
N$17
  Top 0.178: R9.2 35.2,6.78 37.19,6.78 D3.2
N$18
  Top 0.178: R8.2 25.83,6.93 27.66,6.93 D2.2
N$19  (via drill 0.3)
  Top 0.178: v9.07,27.29 9.07,24.92 IC4.27 | v14.48,28.5 14.48,28.35 14.55,28.27 14.55,20.19 13.87,19.51 C27.1
  Bottom 0.178: v9.07,27.29 9.07,27.53 10.04,28.5 v14.48,28.5
N$20  (via drill 0.3)
  Top 0.178: v12.12,20.19 11.51,19.58 9.83,19.58 9.6,19.81 9.6,20.04 IC4.15 | v12.42,26.99 v12.42,29.41 | v11.73,30.1 11.73,33.07 12.19,33.53 C30.2
  Bottom 0.178: v12.12,20.19 12.12,20.59 13.12,21.6 13.12,25.88 12.42,26.59 v12.42,26.99 | v11.73,30.1 v12.42,29.41
N$21  (via drill 0.3)
  Top 0.178: v8.61,19.43 8.61,20.04 IC4.13 | v11.2,30.4 11.2,32.99 10.67,33.53 C29.2
  Bottom 0.178: v11.2,30.4 11.35,30.56 14.78,30.56 15.09,30.25 15.09,28.42 14.71,28.04 12.84,28.04 11.34,26.55 8.85,26.55
  Bottom 0.2: v8.61,19.43 7.5,20.54 7.5,24.15 8.1,24.75 8.1,25.8 8.85,26.55
NRST  (via drill 0.3)
  Top 0.178: v7.09,25.6 7.09,24.92 IC4.31 | v14.63,30.02 16,30.02 v16.46,29.57 | IC1.7 24.61,20.19 22.63,20.19 22.33,19.89 20.95,19.89 v20.95,19.96 20.27,19.28 C21.1 20.19,19.13 20.19,18.36 | 20.19,18.36 20.19,17.68 R2.1 | v19.13,12.72 20.19,11.66 22.63,11.66 S1.1 | v16.92,12.72 16.92,15.09 17.07,15.24 17.07,17.45 17.98,18.36 20.19,18.36
  Bottom 0.178: v7.09,25.6 7.39,25.6 8.05,26.26 8.05,27.05 9.85,28.86 13.46,28.86 v14.63,30.02 | v16.46,29.57 16.46,24.46 v20.95,19.96 | v16.92,12.72 v19.13,12.72
RXD  (via drill 0.3)
  Top 0.178: v24.31,15.54 24.31,17.22 24.61,17.53 24.61,17.68 IC1.12 | v25.38,13.41 25.6,13.18 30.33,13.18 v30.56,13.41
  Bottom 0.178: v24.31,15.54 24.31,14.94 25.38,13.87 v25.38,13.41 | v30.56,13.41 33.53,16.38 35.05,16.38 J4.3
SCK_A  (via drill 0.3)
  Top 0.178: v4.72,20.34 5.56,21.18 5.87,21.18 IC4.7 | v19.66,9.07 v15.85,9.07 | v27.58,15.7 27.58,15.85 27.43,16 27.43,16.99 IC1.17
  Bottom 0.178: v4.72,20.34 4.34,19.96 4.34,18.59 9.53,13.41 11.51,13.41 v15.85,9.07 | v19.66,9.07 24.69,9.07 27.58,11.96 v27.58,15.7
SCL  (via drill 0.3)
  Top 0.178: IC4.10 7.01,20.04 7.01,19.81 5.33,18.14 3.05,18.14 R15.2 3.35,18.06 3.35,13.56 v3.66,13.26 | v27.89,16.23 27.89,16.99 IC1.18 | v32.46,23.32 32.46,23.47 33.07,24.08 33.07,24.46 v33.15,24.54 | v16.99,10.9 v13.34,10.9
  Bottom 0.178: v32.46,23.32 32.46,20.27 28.42,16.23 v27.89,16.23 27.43,16.23 27.13,15.93 27.13,13.87 24.16,10.9 v16.99,10.9 | v33.15,24.54 35.05,24.54 J3.4 | v3.66,13.26 5.49,11.43 9.45,11.43 9.98,10.9 v13.34,10.9
SD_A  (via drill 0.3)
  Top 0.178: v4.72,21.03 4.72,21.72 5.18,22.17 5.87,22.17 IC4.5 | v31.39,23.77 31.39,23.39 31.55,23.24 IC1.36
  Bottom 0.178: v4.72,21.03 8.91,16.84 8.91,15.54 9.75,14.71 19.43,14.71 19.74,15.01 21.87,15.01 25.91,19.05 26.21,19.05 26.52,19.36 26.52,19.66 26.9,20.04 27.2,20.04 27.51,20.34 27.51,20.65 27.89,21.03 28.19,21.03 28.5,21.34 28.5,21.64 28.88,22.02 29.18,22.02 29.49,22.33 29.49,22.63 30.63,23.77 v31.39,23.77
SD_MISO  (via drill 0.3)
  Top 0.178: v26.98,24.69 27.36,24.31 27.36,23.93 IC1.44 | v23.24,21.26 22.63,21.26 v22.33,20.95 | v16.61,15.47 16.61,13.18 14.78,11.35 11.05,11.35 10.21,10.52 7.92,10.52 | v7.09,10.52 7.92,10.52 | v4.04,20.34 3.05,21.34 R13.2 | 7.92,10.52 v7.92,14.25
  Bottom 0.178: v26.98,24.69 26.59,24.69 23.24,21.34 v23.24,21.26 | v22.33,20.95 22.33,20.8 22.55,20.57 22.55,19.66 18.36,15.47 v16.61,15.47 | v7.09,10.52 3.43,10.52 0.3,13.64 0.3,14.78 1.22,15.7 2.44,15.7 2.59,15.85 2.59,16.76 1.98,17.37 1.37,17.37 J9.7 | v4.04,20.34 4.04,18.14 v7.92,14.25
SD_MOSI  (via drill 0.3)
  Top 0.178: v21.26,15.47 22.48,14.25 24.99,14.25 26.82,16.08 26.82,16.99 IC1.16 | v21.26,17.22 21.26,19.2 v21.11,19.36 | v3.89,24.31 3.66,24.54 3.05,24.54 R11.2
  Bottom 0.178: v21.26,17.22 v21.26,15.47 | v21.11,19.36 20.88,19.36 15.39,24.84 15.39,30.4 14.94,30.86 10.52,30.86 3.92,24.27 | 3.92,24.27 2.59,22.94 2.59,22.48 1.98,21.87 1.37,21.87 J9.3 | v3.89,24.31 3.92,24.27
SD_SCK  (via drill 0.3)
  Top 0.178: v23.24,18.67 24.61,18.67 IC1.10 | v8.53,13.72 v9.98,15.16 | v3.73,22.25 3.05,22.94 R12.2
  Bottom 0.178: v23.24,18.67 22.02,18.67 18.36,15.01 10.13,15.01 v9.98,15.16 | v8.53,13.72 7.77,13.72 7.09,14.4 7.09,14.55 2.06,19.58 1.37,19.58 J9.5 2.29,19.43 3.73,20.88 v3.73,22.25
SD_SS  (via drill 0.3)
  Top 0.178: v28.35,15.7 28.35,16.99 IC1.19 | v19.43,7.32 19.05,6.93 v13.56,6.93 | v5.11,10.06 0.46,14.71 v0.46,24.77
  Bottom 0.178: v28.35,15.7 28.35,12.27 23.39,7.32 v19.43,7.32 | v13.56,6.93 12.34,5.71 11.51,5.71 7.16,10.06 v5.11,10.06 | v0.46,24.77 2.29,24.77 2.59,24.46 2.59,23.55 1.98,22.94 1.37,22.94 J9.2
SDA  (via drill 0.3)
  Top 0.178: 5.03,19.28 5.79,20.04 6.48,20.04 IC4.9 | 5.03,19.28 3.43,19.28 3.05,19.66 R14.2 | v27.81,25.68 27.2,25.68 25.91,24.38 25.91,23.93 IC1.47 | v5.03,18.59 5.03,19.28
  Bottom 0.178: v27.81,25.68 33.68,25.68 33.83,25.53 35.05,25.53 J3.3 35.13,25.45 35.43,25.45 36.73,24.16 36.73,13.41 29.87,6.55 19.05,6.55 11.89,13.72 9.83,13.72 8.31,15.24 8.31,15.32 v5.03,18.59
SPL_M  (via drill 0.3)
  Top 0.2: 11.65,27.4 11.65,26.05 v12.15,25.55
  Top 0.203: J7.04 9.34,32.97 10.1,32.2 10.1,28.95 11.65,27.4 | IC4.19 v12.1,21.75
  Bottom 0.203: v12.1,21.75 12.1,22.2 12.4,22.5 12.4,25.05 12.15,25.3 v12.15,25.55
SPL_P  (via drill 0.3)
  Top 0.2: IC4.22 11.85,23.25 v11.9,23.3 | 11.3,27.15 11.3,25.65 v11.5,25.45
  Top 0.203: J7.03 8.06,33.63 9.75,31.95 9.75,28.7 11.3,27.15
  Bottom 0.2: v11.5,25.45 11.5,25.2 11.9,24.8 v11.9,23.3
SPR_M  (via drill 0.3)
  Top 0.2: 10.8,27.15 v10.8,25.25 | v11.43,23.73 10.72,23.73 IC4.23
  Top 0.203: J7.02 6.79,34.3 9.35,31.75 9.35,28.6 10.8,27.15
  Bottom 0.2: v11.43,23.73 11.43,24.62 v10.8,25.25
SPR_P
  Top 0.178: 9.6,24.92 IC4.26
  Top 0.203: J7.01 5.53,34.92 8.6,31.85 8.6,29.9 9,29.5 9,28.35 9.55,27.8 IC4.26
SWCLK  (via drill 0.3)
  Top 0.178: v28.12,25.07 28.8,24.38 28.8,23.93 IC1.41
  Bottom 0.178: v28.12,25.07 27.74,25.07 19.96,32.84 19.96,35.89 19.81,36.04 19.05,36.04 18.44,35.43 18.44,35.13 J2.3
SWDIO/SD_B  (via drill 0.3)
  Top 0.178: v5.18,22.71 5.87,22.71 IC4.4 | v10.59,30.25 10.59,32.26 v10.64,32.26 10.57,32.26 9.91,32.92 9.91,34.21 10.06,34.37 12.65,34.37 12.88,34.59 12.88,35.2 v14.63,36.96 | v28.88,28.12 28.88,26.82 29.79,25.91 29.79,23.93 IC1.39
  Bottom 0.178: v5.18,22.71 5.18,24.84 v10.59,30.25 | v10.64,32.26 12.22,32.26 16,36.04 16.76,36.04 17.37,35.43 17.37,35.13 J2.2 | v28.88,28.12 28.19,28.12 19.96,36.35 18.67,36.35 18.06,36.96 v14.63,36.96
TXD  (via drill 0.3)
  Top 0.178: v23.85,18.21 24.61,18.21 IC1.11
  Bottom 0.178: v23.85,18.21 24.08,18.21 25.91,20.04 26.21,20.04 26.52,20.34 26.52,20.65 26.9,21.03 27.2,21.03 27.51,21.34 27.51,21.64 27.89,22.02 28.19,22.02 28.5,22.33 28.5,22.63 30.1,24.23 32.31,24.23 34.14,22.4 34.14,18.06 34.75,17.45 35.05,17.45 J4.2
USB_DN
  Top 0.305: R6.1 31.34,30.48 30.95,30.87 | 30.95,30.87 J1.B7 | J1.A7 29.95,31.35 30.43,30.87 30.95,30.87
USB_DP
  Top 0.305: R5.1 29.75,30.79 29.45,31.09 J1.B6 29.45,33.54 29.63,33.72 30.29,33.72 30.45,33.56 J1.A6
VDD  (via drill 0.3)
  Top 0.254: 24.46,13.18 24.46,12.95 | 24.46,12.95 24.46,8.08 23.32,6.93 22.1,6.93 21.18,7.85 18.59,7.85 S2.2 | 24.46,13.18 25.22,13.95 26.06,13.95 C6.1 | v24.38,12.95 24.46,12.95 | C20.1 20.34,14.4 21.79,14.4 22.94,13.26 24.38,13.26 24.46,13.18 | R15.1 1.45,18.14 1.45,19.66 R14.1 1.45,19.81 1.45,20.57 | 1.45,20.57 1.45,21.26 R13.1 | R11.1 1.52,24.69 1.52,25.15 2.21,25.83 2.21,28.65 2.9,29.34 C37.1 | 1.45,20.57 v2.74,20.57 | 34.06,24.34 v34.06,25.98 | v35.59,20.5 34.9,21.18 C10.1 | 32.61,22.21 32.61,22.63 32.61,22.71 | v12.67,22.02 12.75,21.94 13,21.2 | v8.61,25.6 8.55,25.6 | v18.14,32.69 18.14,32.31 18.06,32.23 18.06,31.77 19.36,30.48 20.95,30.48 21.49,29.95 IC2.5 | 28.17,26.21 25.68,26.21 25.45,25.98 25.36,25.87 | v8.04,31.72 7.01,31.72 C40.1 | IC1.1 24.77,23.32 25.3,23.85 IC1.48 | 28.48,25.73 v28.88,26.14 | 5.3,28.93 v5.3,28.96 | v31.93,13.95 29.57,13.95 C16.1
  Top 0.305: IC1.23 30.36,16.03 29.47,15.14 C16.1 C17.1 27.82,13.97 C6.1 26.19,14.81 26.31,14.94 26.34,14.91 28.35,14.91 28.86,15.42 IC1.20 | IC1.48 25.36,25.87 24.83,26.4 C5.1 C4.1 24.83,30.47 C22.1 23.41,30.5 22.76,29.85 IC2.5 | C8.1 22.2,26.01 22.5,25.7 22.5,23.6 22.89,23.21 IC1.1 | C10.1 C11.1 33.59,22.85 32.95,22.21 32.61,22.21 IC1.34 | C20.1 C19.1 | C19.1 22.29,16.02 22.73,16.46 22.73,19.41 23.04,19.71 IC1.8 | C37.1 3.73,29.6 5.3,28.02 | 5.3,28.93 5.3,28.02 | 5.3,28.02 5.3,23.95 5.5,23.75 IC4.2 | R13.1 R12.1 R11.1 | IC4.28 8.55,25.6 8.55,29.31 7.66,30.2 C39.1 | 13.8,22.8 C41.1 C42.1 13,21.2 12.55,20.75 IC4.17 | IC1.40 29.36,24.85 28.48,25.73 28.17,26.04 28.17,26.21 C18.1 | IC1.35 32.61,22.71 33.44,23.54 33.44,24.05 33.73,24.34 34.06,24.34 C7.1 | R2.2 20.2,16.06 C19.1
  Top 0.61: C38.1 C37.1 | C40.1 C39.1
  Bottom 0.254: V1.P 20.04,12.04 21.95,12.04 V2.P 22.1,12.04 23.93,12.04 V3.P 24,12.12 24,12.57 v24.38,12.95 | v2.74,20.57 2.67,20.65 1.37,20.65 J9.4 | J3.2 35.05,26.44 34.52,26.44 v34.06,25.98 33.98,26.06 28.96,26.06 v28.88,26.14 | v35.59,20.5 35.13,20.04 35.13,18.44 J4.1 35.2,18.36 35.51,18.36 36.04,17.83 36.04,13.72 34.9,12.57 34.59,12.57 33.22,13.95 v31.93,13.95 | v12.67,22.02 12.77,22.12 12.77,25.74 12.35,26.15 9.16,26.15 v8.61,25.6 | 16.46,34.37 16.46,35.05 J2.1 | v18.14,32.69 16.46,34.37 | 16.46,34.37 16.38,34.29 15.7,34.29 13.13,31.72 v8.04,31.72 5.3,28.98 v5.3,28.96

### Text on the board
tNames: SPK & MIC | POWER | USB TYPE C | RST | SIGNAL | BOOT | ERROR | DESIGNED BY SHOPAN DEY | AUDIO
bNames: USB TYPE C | SP R+ | SP R- | SP L+ | SP L- | MIC + | MIC - | VDD | SDIO | SCLK | GND | ST-LINK | I2C | GND | VDD | SDA | SCL | LPUART | VDD | TXD | RXD | GND | SD CARD | BLE AUDIO DSP | REV A, 2023.